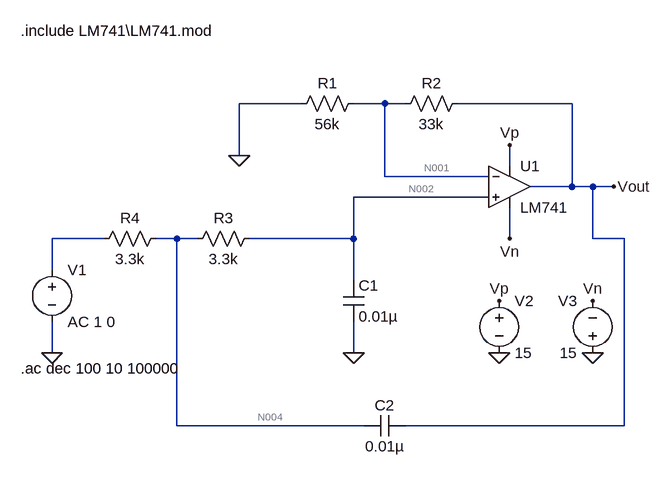
[diagram p0: schematic lpSO.asc]
lpSO.asc, the LTspice schematic file:
Version 4
SHEET 1 880 680
WIRE 192 -48 96 -48
WIRE 320 -48 272 -48
WIRE 352 -48 320 -48
WIRE 608 -48 432 -48
WIRE 96 32 96 -48
WIRE 512 48 512 16
WIRE 320 64 320 -48
WIRE 480 64 320 64
WIRE 608 80 608 -48
WIRE 608 80 544 80
WIRE 640 80 608 80
WIRE 672 80 640 80
WIRE 480 96 272 96
WIRE -112 160 -192 160
WIRE 0 160 -32 160
WIRE 32 160 0 160
WIRE 272 160 272 96
WIRE 272 160 112 160
WIRE 512 160 512 112
WIRE 640 160 640 80
WIRE 688 160 640 160
WIRE -192 208 -192 160
WIRE 272 224 272 160
WIRE -192 336 -192 288
WIRE 272 336 272 288
WIRE 0 448 0 160
WIRE 288 448 0 448
WIRE 688 448 688 160
WIRE 688 448 352 448
FLAG 272 336 0
FLAG -192 336 0
FLAG 96 32 0
FLAG 672 80 Vout
FLAG 512 16 Vp
FLAG 512 160 Vn
FLAG 496 256 Vp
FLAG 640 256 Vn
FLAG 496 336 0
FLAG 640 336 0
SYMBOL res 288 -64 R90
WINDOW 0 0 56 VBottom 2
WINDOW 3 32 56 VTop 2
SYMATTR InstName R1
SYMATTR Value 56k
SYMBOL res 448 -64 R90
WINDOW 0 0 56 VBottom 2
WINDOW 3 32 56 VTop 2
SYMATTR InstName R2
SYMATTR Value 33k
SYMBOL res 128 144 R90
WINDOW 0 0 56 VBottom 2
WINDOW 3 32 56 VTop 2
SYMATTR InstName R3
SYMATTR Value 3.3k
SYMBOL cap 256 224 R0
SYMATTR InstName C1
SYMATTR Value 0.01µ
SYMBOL voltage -192 192 R0
WINDOW 123 0 0 Left 0
WINDOW 39 0 0 Left 0
SYMATTR InstName V1
SYMATTR Value AC 1 0
SYMBOL OpAmps\\opamp2 512 16 R0
SYMATTR InstName U1
SYMATTR Value LM741
SYMBOL voltage 496 240 R0
WINDOW 123 0 0 Left 0
WINDOW 39 0 0 Left 0
SYMATTR InstName V2
SYMATTR Value 15
SYMBOL voltage 640 352 R180
WINDOW 0 24 96 Left 2
WINDOW 3 24 16 Left 2
WINDOW 123 0 0 Left 0
WINDOW 39 0 0 Left 0
SYMATTR InstName V3
SYMATTR Value 15
SYMBOL res -16 144 R90
WINDOW 0 0 56 VBottom 2
WINDOW 3 32 56 VTop 2
SYMATTR InstName R4
SYMATTR Value 3.3k
SYMBOL cap 352 432 R90
WINDOW 0 0 32 VBottom 2
WINDOW 3 32 32 VTop 2
SYMATTR InstName C2
SYMATTR Value 0.01µ
TEXT -240 -160 Left 2 !.include LM741\\LM741.mod
TEXT -240 360 Left 2 !.ac dec 100 10 100000

The netlist it stands for:
* lpSO.asc
R1 N001 0 56k
R2 Vout N001 33k
R3 N002 N004 3.3k
C1 N002 0 0.01µ
V1 N003 0 AC 1 0
XU1 N002 N001 Vp Vn Vout LM741  ; pins In+ In- V+ V- OUT
V2 Vp 0 15
V3 0 Vn 15
R4 N004 N003 3.3k
C2 Vout N004 0.01µ
.include LM741\LM741.mod
.ac dec 100 10 100000
.backanno
.end

* Results of the author's LTspice run, read from the files saved beside the schematic
* Operating Point, zero values left out:
*   V(n001) = 618.1 µV
*   V(vout) = 4.344 mV
*   V(n002) = -381.9 µV
*   V(n004) = -190.9 µV
*   V(vn) = -15 V
*   V(vp) = 15 V
*   I(R4) = -57.86 nA
*   I(R3) = -57.86 nA
*   I(R2) = 112.9 nA
*   I(R1) = 11.04 nA
*   I(V3) = -1.701 mA
*   I(V2) = -1.701 mA
*   I(V1) = -57.86 nA
*   Ix(u1:1) = 57.86 nA
*   Ix(u1:2) = 101.9 nA
*   Ix(u1:99) = 1.701 mA
*   Ix(u1:50) = -1.701 mA
*   Ix(u1:28) = -112.9 nA
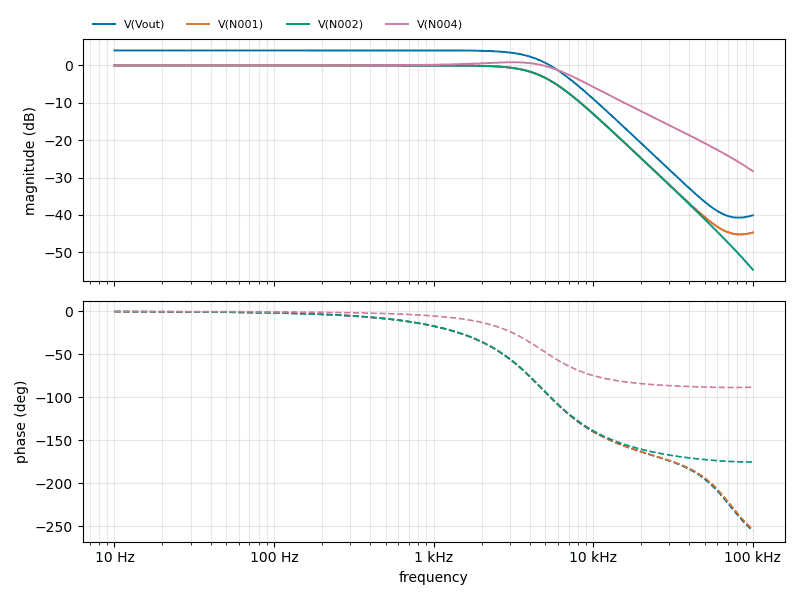
[diagram p1: AC Analysis of lpSO.asc, plotted from the saved traces]
* AC Analysis, 1 run:
*   V(Vout): 4.02 dB at 10 Hz, -40.10 dB at 100 kHz, peak 4.03 dB at 631 Hz, 3 dB below the peak at 4.834 kHz
*   V(N001): 0.00 dB at 10 Hz, -44.70 dB at 100 kHz, peak 0.00 dB at 631 Hz, 3 dB below the peak at 4.834 kHz
*   V(N002): 0.00 dB at 10 Hz, -54.66 dB at 100 kHz, peak 0.00 dB at 616.6 Hz, 3 dB below the peak at 4.833 kHz
*   V(N004): 0.00 dB at 10 Hz, -28.30 dB at 100 kHz, peak 0.86 dB at 3.09 kHz, 3 dB below the peak at 6.745 kHz